# Altium project Backplane Board.PrjPcb
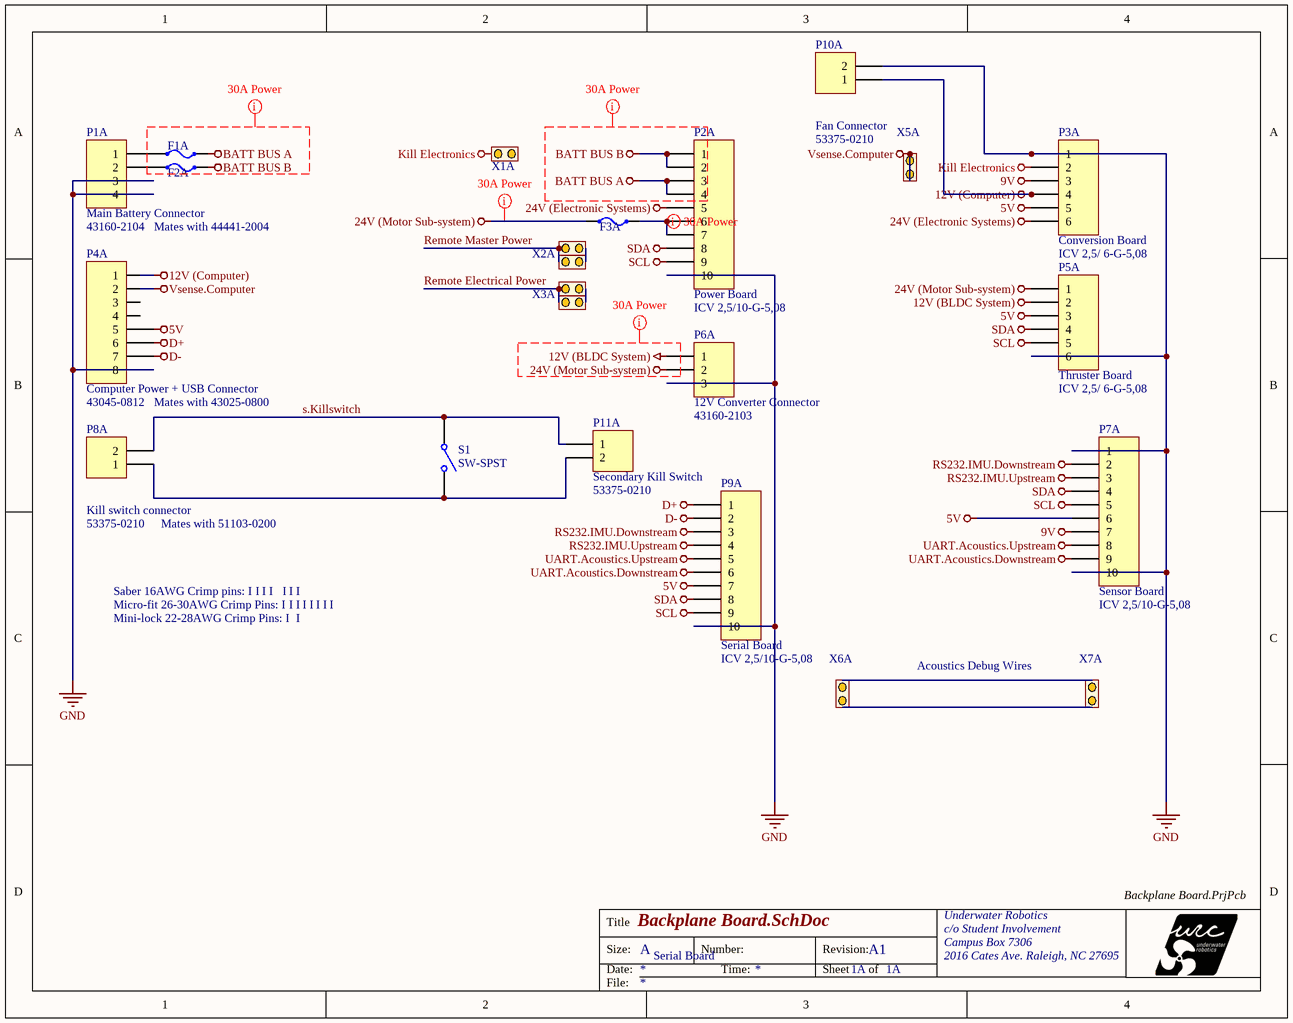
[diagram p0: Backplane Board.SchDoc]
1 sheet, 41 parts. Net scope: global (net labels, ports and power ports of the same name join across sheets).
Board file: Backplane Board.PcbDoc

## Sheet Backplane Board.SchDoc
size A; Organization: Underwater Robotics; Address1: c/o Student Involvement; Address2: Campus Box 7306; Address3: 2016 Cates Ave. Raleigh, NC 27695; Revision: A1; SheetNumber: 1A; SheetTotal: 1A

### Parts
F1A  3588  [Protected Fuse Clip]  (value not drawn)
F2A  3588  [Protected Fuse Clip]  (value not drawn)
F3A  3588  [Protected Fuse Clip]  (value not drawn)
i1A  Saber Connector, 4pin, 44441-2004 (Placeholder)  (value not drawn)
i2A  Micro-Fit Plug8 (placeholder), 43025-0800  (value not drawn)
i3A  General Plug2 (Placeholder), 51103-0200  (value not drawn)
i4A  Saber 16AWG Crimp Pin  (value not drawn)
i5A  Saber 16AWG Crimp Pin  (value not drawn)
i6A  Saber 16AWG Crimp Pin  (value not drawn)
i7A  Saber 16AWG Crimp Pin  (value not drawn)
i8A  Saber 16AWG Crimp Pin  (value not drawn)
i9A  Saber 16AWG Crimp Pin  (value not drawn)
i10A  Saber 16AWG Crimp Pin  (value not drawn)
i11A  Micro-fit 26-30AWG Crimp pin (Placeholder)  (value not drawn)
i12A  Micro-fit 26-30AWG Crimp pin (Placeholder)  (value not drawn)
i13A  Micro-fit 26-30AWG Crimp pin (Placeholder)  (value not drawn)
i14A  Micro-fit 26-30AWG Crimp pin (Placeholder)  (value not drawn)
i15A  Micro-fit 26-30AWG Crimp pin (Placeholder)  (value not drawn)
i16A  Micro-fit 26-30AWG Crimp pin (Placeholder)  (value not drawn)
i17A  Micro-fit 26-30AWG Crimp pin (Placeholder)  (value not drawn)
i18A  Micro-fit 26-30AWG Crimp pin (Placeholder)  (value not drawn)
i19A  Mini-lock 22-28AWG (Placeholder), 50351-8000  (value not drawn)
i20A  Mini-lock 22-28AWG (Placeholder), 50351-8000  (value not drawn)
P1A  Main Battery Connector  Manufacturer Part Number: 43160-2104  [431602104 Header w/ Plug]
P2A  Power Board  [ICV 2,5/10-G-5,08]
P3A  Conversion Board  [ICV 2,5/ 6-G-5,08]
P4A  Computer Power + USB Connector  Manufacturer Part Number: 43045-0812  [43045-0812 Microfit Header w/ plug]
P5A  Thruster Board  [ICV 2,5/ 6-G-5,08]
P6A  12V Converter Connector  Manufacturer Part Number: 43160-2103  [431602103 Header w/ Plug]
P7A  Sensor Board  [ICV 2,5/10-G-5,08]
P8A  Kill switch connector  Manufacturer Part Number: 53375-0210  [533750210 header w/ plug]
P9A  Serial Board  [ICV 2,5/10-G-5,08]
P10A  Fan Connector  Manufacturer Part Number: 53375-0210  [533750210 header w/ plug]
P11A  Secondary Kill Switch  Manufacturer Part Number: 53375-0210  [533750210 header w/ plug]
S1  SW-SPST  [SPST-2]
X1A  Header  [1x2 Header]  (value not drawn)
X2A  Header  [2x2 Header w/ division]  (value not drawn)
X3A  Header  [2x2 Header w/ division]  (value not drawn)
X5A  Header  [1x2 Header]  (value not drawn)
X6A  Header  [1x2 Header]  (value not drawn)
X7A  Header  [1x2 Header]  (value not drawn)

### Nets
5V: P3A.5 P4A.5 P5A.3 P7A.6 P9A.7
9V: P3A.3 P7A.7
12V (BLDC System): P5A.2 P6A.1
12V (Computer): P3A.4 P4A.1 P10A.1
24V (Electronic Systems): P2A.5 P3A.6
24V (Motor Sub-system): F3A.2 P5A.1 P6A.2
BATT BUS A: F1A.1 P2A.3 P2A.4
BATT BUS B: F2A.1 P2A.1 P2A.2
D+: P4A.6 P9A.1
D-: P4A.7 P9A.2
GND: P1A.3 P1A.4 P2A.10 P3A.1 P4A.8 P5A.6 P6A.3 P7A.1 P7A.10 P9A.10 P10A.2
Kill Electronics: P3A.2 X1A.1
RS232.IMU.Downstream: P7A.2 P9A.3
RS232.IMU.Upstream: P7A.3 P9A.4
SCL: P2A.9 P5A.5 P7A.5 P9A.9
SDA: P2A.8 P5A.4 P7A.4 P9A.8
UART.Acoustics.Downstream: P7A.9 P9A.6
UART.Acoustics.Upstream: P7A.8 P9A.5
Vsense.Computer: P4A.2 X5A.1 X5A.2
Remote Electrical Power: X3A.1 X3A.3
Remote Master Power: X2A.1 X2A.3
s.Killswitch: P8A.2 P11A.1 S1.1(COMMON)
NetF1A_2: F1A.2 P1A.1
NetF2A_2: F2A.2 P1A.2
NetF3A_1: F3A.1 P2A.6 P2A.7
NetP8A_1: P8A.1 P11A.2 S1.2(NO)
NetX2A_2: X2A.2 X2A.4
NetX3A_2: X3A.2 X3A.4
NetX6A_1: X6A.1 X7A.1
NetX6A_2: X6A.2 X7A.2

Not connected (* = marked no-connect by the designer): P4A 3 4; X1A 2

### Layout directives
net class High Power: 12V (BLDC System), 24V (Motor Sub-system), BATT BUS A, BATT BUS B, NetF3A_1

### Notes on the sheet
- Acoustics Debug Wires
- Serial Board
- Title
- Size:
- Date:
- A
- Number:
- Time:
- Revision:
- Sheet
- of
- File:
- (in symbol General Plug2 (Placeholder), 51103-0200) Mates with 51103-0200
- (in symbol Micro-fit 26-30AWG Crimp pin (Placeholder)) Micro-fit 26-30AWG Crimp Pins: I; I
- (in symbol Micro-Fit Plug8 (placeholder), 43025-0800) Mates with 43025-0800
- (in symbol Mini-lock 22-28AWG (Placeholder), 50351-8000) Mini-lock 22-28AWG Crimp Pins: I; I
- (in symbol Saber 16AWG Crimp Pin) Saber 16AWG Crimp pins: I; I
- (in symbol Saber Connector, 4pin, 44441-2004 (Placeholder)) Mates with 44441-2004

### Library data of the parts
F1A F2A F3A = 3588: Fuse Holder Assembly; Manufacturer 1: KEYSTONE; Subassembly: Yes; Description 1: KEYSTONE - 3588 - FUSE HOLDER, AUTO BLADE, SMT; Manufacturer Part Number: 3588; Supplier 1: Newark; Supplier Part Number 1: 24T5061; RoHS: YES; Stock 1: 99; Pricing 1: 1=0.929, 50=0.783, 100=0.75, 250=0.686, 500=0.66, 1000=0.572, 2500=0.497, 5000=0.481 (USD); ComponentLink1URL: http://www.farnell.com/datasheets/1703973.pdf; ComponentLink1Description: http://www.farnell.com/datasheets/1703973.pdf
i1A = Saber Connector, 4pin, 44441-2004 (Placeholder): Saber connector, plug, 4 pin; Manufacturer 1: MOLEX; Description 1: MOLEX - 44441-2004 - PLUG & SOCKET HOUSING, RECEPTACLE, NYLON; Product Range: 44441 Series; No. of Positions: 4; Pitch Spacing: 7.5; For Use With: 43375 Female Crimp Terminals; Body Material: PA Polyamide (Nylon); Connector Type: Plug & Socket; Supplier 1: Newark; Supplier Part Number 1: 06H1124; RoHS: YES; Stock 1: 3414; Pricing 1: 1=1.09, 10=0.893, 100=0.784, 500=0.647, 1000=0.588, 2000=0.531, 5000=0.502, 10000=0.456 (USD); Colour: Black; ComponentLink1URL: http://www.farnell.com/datasheets/1024325.pdf; ComponentLink1Description: http://www.farnell.com/datasheets/1024325.pdf; ComponentLink2URL: http://www.farnell.com/cad/1924362.pdf; ComponentLink2Description: http://www.farnell.com/cad/1924362.pdf; ComponentLink3URL: http://www.farnell.com/cad/1976324.zip; ComponentLink3Description: http://www.farnell.com/cad/1976324.zip; ComponentLink4URL: http://www.farnell.com/datasheets/1997048.pdf; ComponentLink4Description: http://www.farnell.com/datasheets/1997048.pdf; ComponentLink5URL: http://www.molex.com/molex/products/datasheet.jsp?part=active/0444412004_CRIMP_HOUSINGS.xml&channel=Products&Lang=en-US; ComponentLink5Description: http://www.molex.com/molex/products/datasheet.jsp?part=active/0444412004_CRIMP_HOUSINGS.xml&channel=Products&Lang=en-US; Manufacturer Part Number: 44441-2004
i2A = Micro-Fit Plug8 (placeholder), 43025-0800: 8pin micro-fit connector, 43025-0800; Manufacturer 1: MOLEX; Description 1: MOLEX - 43025-0800 - PLUG & SOCKET CONNECTOR, RECEPTACLE, 8 POSITION, 3MM; Product Range: Micro-Fit 3.0 Series; No. of Positions: 8; Pitch Spacing: 3; For Use With: Micro-Fit 3.0 Crimp Socket Terminals; Body Material: Polyester; No. of Rows: 2; Supplier 1: Newark; Supplier Part Number 1: 56H9400; RoHS: YES; Stock 1: 6691; Pricing 1: 1=0.53, 10=0.485, 100=0.395, 500=0.375, 1000=0.355, 2000=0.254, 5000=0.236 (USD); Colour: Black; ComponentLink1URL: http://www.farnell.com/datasheets/1024186.pdf; ComponentLink1Description: http://www.farnell.com/datasheets/1024186.pdf; ComponentLink2URL: http://www.farnell.com/cad/1843461.pdf; ComponentLink2Description: http://www.farnell.com/cad/1843461.pdf; ComponentLink3URL: http://www.farnell.com/cad/1989864.zip; ComponentLink3Description: http://www.farnell.com/cad/1989864.zip; ComponentLink4URL: http://www.farnell.com/datasheets/2000684.pdf; ComponentLink4Description: http://www.farnell.com/datasheets/2000684.pdf; Manufacturer Part Number: 43025-0800
i3A = General Plug2 (Placeholder), 51103-0200: Molex Wire2PCB connector, 2pin; Description 1: MOLEX - 51103-0200 - WIRE-BOARD CONNECTOR, RECEPTACLE, 2 POSITION, 2.5MM; Product Range: 51103 Series; Gender: Receptacle; No. of Contacts: 2; Pitch Spacing: 2.5; No. of Rows: 1; Supplier 1: Newark; Supplier Part Number 1: 25H8708; Manufacturer 1: MOLEX; RoHS: YES; Stock 1: 742; Pricing 1: 1=0.16, 10=0.15, 25=0.128, 50=0.112, 100=0.092, 500=0.086, 1000=0.06, 5000=0.058 (USD); Contact Termination Type: -; Contact Plating: -; Contact Material: -; ComponentLink1URL: http://www.farnell.com/datasheets/1024824.pdf; ComponentLink1Description: http://www.farnell.com/datasheets/1024824.pdf; ComponentLink2URL: http://www.farnell.com/cad/1805879.pdf; ComponentLink2Description: http://www.farnell.com/cad/1805879.pdf; ComponentLink3URL: http://www.farnell.com/cad/1985113.zip; ComponentLink3Description: http://www.farnell.com/cad/1985113.zip; ComponentLink4URL: http://www.farnell.com/datasheets/2000598.pdf; ComponentLink4Description: http://www.farnell.com/datasheets/2000598.pdf; Manufacturer Part Number: 51103-0200
i4A i5A i6A i7A i8A i9A i10A = Saber 16AWG Crimp Pin: Manufacturer 1: MOLEX; Manufacturer Part Number: 43375-0001; Description 1: MOLEX - 43375-0001 - CONTACT, SOCKET, 16-14AWG, CRIMP; Product Range: Sabre Series; Wire Size AWG Min: 16; Wire Size AWG Max: 14; Supplier 1: Newark; Supplier Part Number 1: 85C4564; RoHS: YES; Stock 1: 2607; Pricing 1: 1=0.17, 10=0.159, 25=0.119, 50=0.102, 100=0.099, 250=0.085, 500=0.082, 1000=0.072 (USD); Contact Plating: Tin Plated Contacts; Contact Material: Brass; Contact Gender: Socket; Contact Termination Type: Crimp; ComponentLink1URL: http://www.farnell.com/cad/1848130.pdf; ComponentLink1Description: http://www.farnell.com/cad/1848130.pdf; ComponentLink2URL: http://www.farnell.com/datasheets/1998429.pdf; ComponentLink2Description: http://www.farnell.com/datasheets/1998429.pdf; ComponentLink3URL: http://www.molex.com/pdm_docs/sd/433750001_sd.pdf; ComponentLink3Description: http://www.molex.com/pdm_docs/sd/433750001_sd.pdf
i11A i12A i13A i14A i15A i16A i17A i18A = Micro-fit 26-30AWG Crimp pin (Placeholder): Standard Crimp pin for Micro-fit series; Manufacturer 1: MOLEX; Manufacturer Part Number: 43030-0005; Description 1: MOLEX - 43030-0005 - CONTACT, SOCKET, 30-26AWG, CRIMP; Supplier 1: Newark; Supplier Part Number 1: 56H9411; RoHS: YES; Stock 1: 115018; Pricing 1: 1=0.07, 10=0.07, 100=0.07, 500=0.065, 1000=0.06, 5000=0.06 (USD); ComponentLink1URL: http://www.farnell.com/cad/1946876.pdf; ComponentLink1Description: http://www.farnell.com/cad/1946876.pdf; ComponentLink2URL: http://www.farnell.com/cad/1977723.zip; ComponentLink2Description: http://www.farnell.com/cad/1977723.zip; ComponentLink3URL: http://www.farnell.com/datasheets/1975191.pdf; ComponentLink3Description: http://www.farnell.com/datasheets/1975191.pdf
i19A i20A = Mini-lock 22-28AWG (Placeholder), 50351-8000: Standard Crimp pin for Mini-lock series; Manufacturer 1: MOLEX; Description 1: MOLEX - 50351-8000 - CONTACT, FEMALE, 28-22AWG, CRIMP; Product Range: 50351 Series; Wire Size AWG Min: 28; Wire Size AWG Max: 22; Supplier 1: Newark; Supplier Part Number 1: 26H1675; RoHS: YES; Stock 1: 3267; Pricing 1: 1=0.12, 10=0.109, 25=0.081, 50=0.07, 100=0.067, 250=0.058, 500=0.056, 1000=0.049 (USD); Contact Gender: Socket; Contact Termination Type: Crimp; Contact Material: Phosphor Bronze; Contact Size: 22; ComponentLink1URL: http://www.farnell.com/datasheets/1024778.pdf; ComponentLink1Description: http://www.farnell.com/datasheets/1024778.pdf; ComponentLink2URL: http://www.farnell.com/cad/154087.pdf; ComponentLink2Description: http://www.farnell.com/cad/154087.pdf; ComponentLink3URL: http://www.farnell.com/cad/1983916.zip; ComponentLink3Description: http://www.farnell.com/cad/1983916.zip; ComponentLink4URL: http://www.farnell.com/datasheets/2000606.pdf; ComponentLink4Description: http://www.farnell.com/datasheets/2000606.pdf; ComponentLink5URL: http://www.molex.com/molex/products/datasheet.jsp?part=active/0503518000_CRIMP_TERMINALS.xml&channel=Products&Lang=en-US; ComponentLink5Description: http://www.molex.com/molex/products/datasheet.jsp?part=active/0503518000_CRIMP_TERMINALS.xml&channel=Products&Lang=en-US; Manufacturer Part Number: 50351-8000
P1A = Molex Header 4, 43160-2104: Manufacturer 1: MOLEX; Description 1: MOLEX - 43160-2104 - CONNECTOR, HEADER, 4POS, 1ROW, 7.5MM; Product Range: Sabre 43160 Series; Contact Termination Type: Through Hole; Gender: Header; No. of Contacts: 4; Pitch Spacing: 7.5; Supplier 1: Newark; Supplier Part Number 1: 56H9807; RoHS: YES; Stock 1: 827; Pricing 1: 1=2.45, 10=2.09, 100=1.71, 500=1.53, 1000=1.38, 2000=1.29, 5000=1.25 (USD); Contact Plating: Tin Plated Contacts; Contact Material: Brass; ComponentLink1URL: http://www.farnell.com/cad/1942453.pdf; ComponentLink1Description: http://www.farnell.com/cad/1942453.pdf; ComponentLink2URL: http://www.farnell.com/datasheets/1968648.pdf; ComponentLink2Description: http://www.farnell.com/datasheets/1968648.pdf; ComponentLink3URL: http://www.farnell.com/cad/1989934.zip; ComponentLink3Description: http://www.farnell.com/cad/1989934.zip
P2A P7A P9A = ICV 2,5/10-G-5,08: Header, 10-Pin; Manufacturer 1: PHOENIX CONTACT; Description 1: PHOENIX CONTACT - ICV 2,5/10-G-5,08 - TERMINAL BLOCK, SOCKET, 10POS, TH; Supplier 1: Newark; Supplier Part Number 1: 69R9559; RoHS: YES; Stock 1: 50; Pricing 1: 1=9.77, 10=9.51, 25=9.26, 50=8.89, 100=8.17, 250=7.55, 500=7.2, 1000=6.4 (USD); ComponentLink1URL: http://www.farnell.com/datasheets/528338.pdf; ComponentLink1Description: http://www.farnell.com/datasheets/528338.pdf; Manufacturer Part Number: ICV 2,5/10-G-5,08
P3A P5A = ICV 2,5/ 6-G-5,08: Header, 6-Pin; Manufacturer 1: PHOENIX CONTACT; Description 1: PHOENIX CONTACT - ICV 2,5/ 6-G-5,08 - TERMINAL BLOCK, SOCKET, 6POS, TH; Supplier 1: Newark; Supplier Part Number 1: 69R9557; RoHS: YES; Stock 1: 167; Pricing 1: 1=5.83, 10=5.67, 25=5.52, 50=5.3, 100=4.87, 250=4.5, 500=4.29, 1000=3.82 (USD); ComponentLink1URL: http://www.farnell.com/datasheets/528336.pdf; ComponentLink1Description: http://www.farnell.com/datasheets/528336.pdf; Manufacturer Part Number: ICV 2,5/ 6-G-5,08
P4A = Molex Header 8, 43045-0812: Manufacturer 1: MOLEX; Description 1: MOLEX - 43045-0812 - PLUG & SOCKET CONNECTOR, HEADER, 8 POSITION, 3MM; Supplier 1: Newark; Supplier Part Number 1: 89C1127; RoHS: YES; Stock 1: 174; Pricing 1: 1=1.72, 10=1.4, 100=1.27, 500=1.01, 1000=0.92, 2000=0.784 (USD); ComponentLink1URL: http://www.farnell.com/cad/1243826.pdf; ComponentLink1Description: http://www.farnell.com/cad/1243826.pdf; ComponentLink2URL: http://www.farnell.com/datasheets/1964610.pdf; ComponentLink2Description: http://www.farnell.com/datasheets/1964610.pdf; ComponentLink3URL: http://www.farnell.com/cad/1976739.zip; ComponentLink3Description: http://www.farnell.com/cad/1976739.zip
P6A = Molex Header, 431602103: Manufacturer 1: MOLEX; Description 1: MOLEX - 43160-2103 - CONNECTOR, HEADER, 3POS, 1ROW, 7.5MM; Product Range: Sabre 43160 Series; Contact Termination Type: Through Hole; Gender: Header; No. of Contacts: 3; Pitch Spacing: 7.5; Supplier 1: Newark; Supplier Part Number 1: 56H9806; RoHS: YES; Stock 1: 762; Pricing 1: 1=1.73, 10=1.48, 100=1.21, 500=1.09, 1000=0.975, 2000=0.91, 5000=0.885 (USD); Contact Plating: Tin Plated Contacts; Contact Material: Brass; ComponentLink1URL: http://www.farnell.com/cad/1942453.pdf; ComponentLink1Description: http://www.farnell.com/cad/1942453.pdf; ComponentLink2URL: http://www.farnell.com/datasheets/1968276.pdf; ComponentLink2Description: http://www.farnell.com/datasheets/1968276.pdf; ComponentLink3URL: http://www.farnell.com/cad/1976713.zip; ComponentLink3Description: http://www.farnell.com/cad/1976713.zip
P8A P10A P11A = Molex Header 2,  53375-0210: Manufacturer 1: MOLEX; Description 1: MOLEX - 53375-0210 - WIRE-BOARD CONNECTOR HEADER, 2 POSITION, 2.5MM; Product Range: Mini-Lock 53375 Series; Contact Termination Type: Through Hole; Gender: Header; No. of Contacts: 2; Pitch Spacing: 2.5; No. of Rows: 1; Supplier 1: Newark; Supplier Part Number 1: 57H5345; RoHS: YES; Stock 1: 5139; Pricing 1: 1=0.49, 10=0.37, 100=0.3, 500=0.293, 1000=0.254, 2000=0.208, 5000=0.205, 10000=0.192 (USD); Contact Plating: Tin Plated Contacts; ComponentLink1URL: http://www.farnell.com/datasheets/1024877.pdf; ComponentLink1Description: http://www.farnell.com/datasheets/1024877.pdf; ComponentLink2URL: http://www.farnell.com/cad/1843463.pdf; ComponentLink2Description: http://www.farnell.com/cad/1843463.pdf; ComponentLink3URL: http://www.farnell.com/datasheets/1957448.pdf; ComponentLink3Description: http://www.farnell.com/datasheets/1957448.pdf; ComponentLink4URL: http://www.farnell.com/cad/1990318.zip; ComponentLink4Description: http://www.farnell.com/cad/1990318.zip
S1 = SW-SPST: Single-Pole, Single-Throw Switch; Published: 24-Mar-1999; LatestRevisionDate: 17-Jul-2002; LatestRevisionNote: Re-released for DXP Platform.; PackageReference: SPST-2; Publisher: Altium Limited; PackageDescription: Switch; 2 Leads
X1A X5A X6A X7A = 1x2 Header
X2A X3A = 2x2 Header